# Altium project Rear.PrjPCB (part 1 of 2)
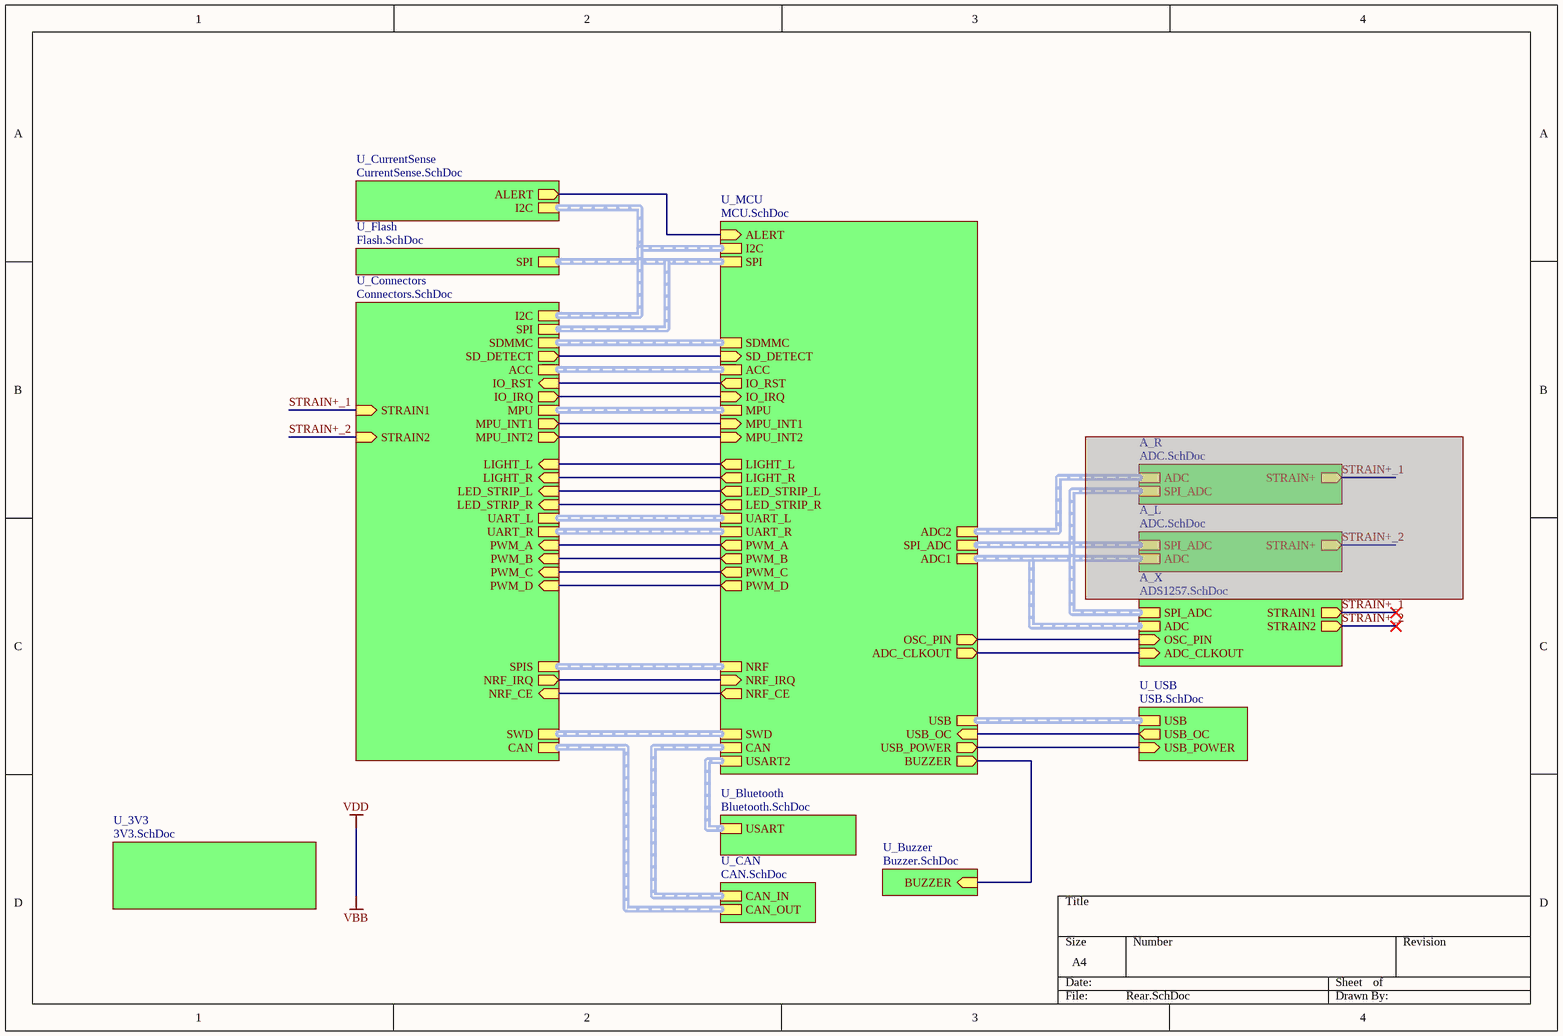
[diagram p0: Rear.SchDoc]
11 sheets, 199 parts. Net scope: hierarchical (ports join the sheet entries above them; power ports are global).
Board file: Rear.PcbDoc
Sheets:
  Rear.SchDoc
    U_CAN = CAN.SchDoc
    U_Bluetooth = Bluetooth.SchDoc
    U_3V3 = 3V3.SchDoc
    U_Flash = Flash.SchDoc
    A_X = ADS1257.SchDoc
    U_MCU = MCU.SchDoc
    U_Connectors = Connectors.SchDoc
    U_USB = USB.SchDoc
    U_CurrentSense = CurrentSense.SchDoc

## Sheet Rear.SchDoc
size A4

### Sub-sheets
A_L = ADC.SchDoc (masked out): SPI_ADC (harness SPI_ADC), ADC (harness ADC), STRAIN+ (out)
A_R = ADC.SchDoc (masked out): SPI_ADC (harness SPI_ADC), ADC (harness ADC), STRAIN+ (out)
A_X = ADS1257.SchDoc: SPI_ADC (harness SPI_ADC), ADC (harness ADC), STRAIN1 (out), STRAIN2 (out), OSC_PIN (in), ADC_CLKOUT (in)
U_3V3 = 3V3.SchDoc: no entries
U_Bluetooth = Bluetooth.SchDoc: USART (harness USART2)
U_Buzzer = Buzzer.SchDoc (file not in this document): BUZZER (in)
U_CAN = CAN.SchDoc: CAN_IN (harness CAN Input), CAN_OUT (harness CAN Output)
U_Connectors = Connectors.SchDoc: CAN (harness CAN Output), MPU (harness I2C), MPU_INT1 (out), MPU_INT2 (out), STRAIN1 (in), STRAIN2 (in), LED_STRIP_L (in), LED_STRIP_R (in), IO_RST (in), IO_IRQ (out), LIGHT_L (in), LIGHT_R (in), SPIS (harness SPI), SDMMC (harness SDMMC), SD_DETECT (out), NRF_CE (in), NRF_IRQ (out), UART_L (harness USART2), UART_R (harness USART2), PWM_A (in), PWM_B (in), PWM_C (in), PWM_D (in), SPI (harness SPI), I2C, ACC, SWD
U_CurrentSense = CurrentSense.SchDoc: ALERT (out), I2C (harness I2C)
U_Flash = Flash.SchDoc: SPI (harness SPI)
U_MCU = MCU.SchDoc: CAN (harness CAN Input), ACC (harness Accessory Outputs), I2C (harness I2C), SPI_ADC (harness SPI_ADC), USART2 (harness USART2), ADC1 (harness ADC), ADC2 (harness ADC), MPU (harness I2C), MPU_INT1 (in), MPU_INT2 (in), SPI, LED_STRIP_L (out), LED_STRIP_R (out), IO_RST (out), IO_IRQ (in), LIGHT_L (out), LIGHT_R (out), NRF (harness SPI), SD_DETECT (in), NRF_CE (out), NRF_IRQ (in), OSC_PIN (out), UART_L (harness USART2), UART_R (harness USART2), PWM_A (out), PWM_B (out), USB (harness USB), BUZZER (out), USB_POWER (out), USB_OC (in), SDMMC, ALERT (in), PWM_C (out), PWM_D (out), SWD (harness SWD), ADC_CLKOUT (out)
U_USB = USB.SchDoc: USB_POWER (in), USB_OC (out), USB (harness USB)

### Nets
ALERT: sheet U_MCU/ALERT, sheet U_CurrentSense/ALERT
BUZZER: sheet U_MCU/BUZZER, sheet U_Buzzer/BUZZER
LIGHT_L: sheet U_MCU/LIGHT_L, sheet U_Connectors/LIGHT_L
LIGHT_R: sheet U_MCU/LIGHT_R, sheet U_Connectors/LIGHT_R
STRAIN+_1: sheet A_X/STRAIN1, sheet U_Connectors/STRAIN1  [project net AINP1]
STRAIN+_2: sheet A_X/STRAIN2, sheet U_Connectors/STRAIN2  [project net AINP2]
NetC94_2: sheet U_MCU/PWM_A, sheet U_Connectors/PWM_A
NetC95_2: sheet U_MCU/PWM_B, sheet U_Connectors/PWM_B
NetC96_2: sheet U_MCU/PWM_C, sheet U_Connectors/PWM_C
NetC97_2: sheet U_MCU/PWM_D, sheet U_Connectors/PWM_D
NetD22_C: sheet U_MCU/USB_OC, sheet U_USB/USB_OC
NetJP8_2: sheet U_MCU/LED_STRIP_L, sheet U_Connectors/LED_STRIP_L
NetJP9_2: sheet U_MCU/LED_STRIP_R, sheet U_Connectors/LED_STRIP_R
NetJP10_1: sheet U_MCU/MPU_INT1, sheet U_Connectors/MPU_INT1
NetJP11_1: sheet U_MCU/MPU_INT2, sheet U_Connectors/MPU_INT2
NetJP18_3: sheet U_MCU/NRF_CE, sheet U_Connectors/NRF_CE
NetJP18_8: sheet U_MCU/NRF_IRQ, sheet U_Connectors/NRF_IRQ
NetJP19_9: sheet U_MCU/SD_DETECT, sheet U_Connectors/SD_DETECT
NetP1_1: sheet U_MCU/IO_IRQ, sheet U_Connectors/IO_IRQ
NetP1_2: sheet U_MCU/IO_RST, sheet U_Connectors/IO_RST
NetR93_1: sheet A_X/OSC_PIN, sheet U_MCU/OSC_PIN
NetR107_2: sheet U_MCU/USB_POWER, sheet U_USB/USB_POWER
NetR118_1: sheet A_X/ADC_CLKOUT, sheet U_MCU/ADC_CLKOUT

### Buses and harness runs
harness sheet A_X/ADC = sheet U_MCU/ADC1
harness sheet A_X/SPI_ADC = sheet U_MCU/SPI_ADC
harness sheet U_Bluetooth/USART = sheet U_MCU/USART2
harness sheet U_CAN/CAN_IN = sheet U_MCU/CAN
harness sheet U_CAN/CAN_OUT = sheet U_Connectors/CAN
harness sheet U_Connectors/ACC = sheet U_MCU/ACC
harness sheet U_Connectors/I2C = sheet U_CurrentSense/I2C = sheet U_MCU/I2C
harness sheet U_Connectors/MPU = sheet U_MCU/MPU
harness sheet U_Connectors/SDMMC = sheet U_MCU/SDMMC
harness sheet U_Connectors/SPI = sheet U_Flash/SPI = sheet U_MCU/SPI
harness sheet U_Connectors/SPIS = sheet U_MCU/NRF
harness sheet U_Connectors/SWD = sheet U_MCU/SWD
harness sheet U_Connectors/UART_L = sheet U_MCU/UART_L
harness sheet U_Connectors/UART_R = sheet U_MCU/UART_R
harness sheet U_MCU/USB = sheet U_USB/USB

## Sheet CAN.SchDoc
size A; SheetNumber: 9
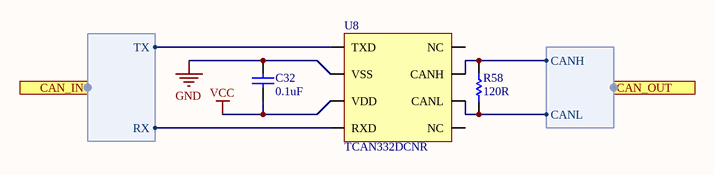
[diagram p1: CAN.SchDoc]

### Parts
C32  value 0.1uF  [C0603[1608X92]]  (hidden comment: 0.1uF 6.3V 0603)
R58  value 120R  [R0603[1608]]  (hidden comment: 120R 1% 0603)
U8  TCAN332DCNR  [SOT-23-8]

### Ports
CAN_IN (harness CAN Input), CAN_OUT (harness CAN Output)

### Harnesses
CAN Input: TX, RX
CAN Output: CANH, CANL

### Nets
GND: C32.2 U8.2(VSS)
VCC: C32.1 U8.3(VDD)
CAN.RX: U8.4(RXD) ; port CAN_IN.RX
CAN.TX: U8.1(TXD) ; port CAN_IN.TX
NetJP3_1: R58.2 U8.7(CANH) ; port CAN_OUT.CANH
NetJP3_2: R58.1 U8.6(CANL) ; port CAN_OUT.CANL

Not connected (* = marked no-connect by the designer): U8 5(NC) 8(NC)

### Library data of the parts
C32 = CAP_0.1uF_6.3V_0603_10%: 0.1uF 6.3V 10% 0603 (1608 Metric); PartNumber: GRM188R70J104KA01D; Manufacturer: Murata; Mounting Technology: Surface Mount; PackageReference: 0603; PackageDescription: 0603 (1608 Metric); Voltage: 6.3V; Tolerance: 10%
R58 = RES_120R_0603_1%: 120R 0.25W 1% 0603 (1005 Metric); Manufacturer: Vishay / Dale; PartNumber: CRCW0603120RFKEAHP; Tolerance: 1%; Power: 0.25W; Mounting Technology: Surface Mount; PackageReference: 0603; PackageDescription: 0603 (1608 Metric); ComponentLink1Description: Datasheet; ComponentLink1URL: http://www.vishay.com/docs/20043/crcwhpe3.pdf
U8 = TCAN332DCNR: CAN Interface IC 3.3-V CAN Transceivers with CAN FD (Flexible Data Rate) 8-SOT-23 -40 to 125; Manufacturer: Texas Instruments; Mounting Technology: Surface Mount; PackageReference: SOT-23-8; PackageDescription: SOT23, 8-Leads; PartNumber: TCAN332DCNR

## Sheet Bluetooth.SchDoc
size A4
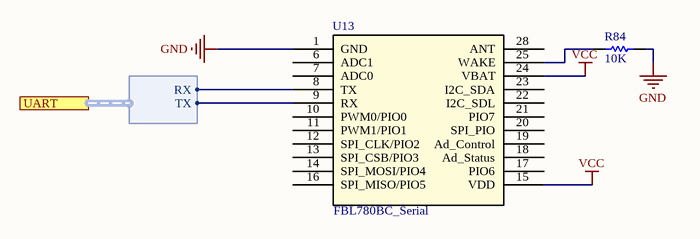
[diagram p2: Bluetooth.SchDoc]

### Parts
R84  value 10K  [R0603[1608]]  (hidden comment: 10K 1% 0603)
U13  FBL780BC_Serial  [FBL780BC_Serial]

### Ports
UART (harness USART2)

### Harnesses
USART2: TX, RX

### Nets
GND: R84.2 U13.1(GND)
VCC: U13.15(VDD) U13.24(VBAT)
NetR84_1: R84.1 U13.25(WAKE)
NetU13_8: U13.8(TX) ; port UART.RX
NetU13_9: U13.9(RX) ; port UART.TX

Not connected (* = marked no-connect by the designer): U13 6(ADC1) 7(ADC0) 10(PWM0/PIO0) 11(PWM1/PIO1) 12(SPI_CLK/PIO2) 13(SPI_CSB/PIO3) 14(SPI_MOSI/PIO4) 16(SPI_MISO/PIO5) 17(PIO6) 18(Ad_Status) 19(Ad_Control) 20(SPI_PIO) 21(PIO7) 22(I2C_SDL) 23(I2C_SDA) 28(ANT)

### Library data of the parts
R84 = RES_10K_0603_1%: 10K 0.25W 1% 0603 (1005 Metric); Manufacturer: Vishay / Dale; PartNumber: CRCW060310K0FKEAHP; Tolerance: 1%; Power: 0.25W; Mounting Technology: Surface Mount; PackageReference: 0603; PackageDescription: 0603 (1608 Metric); ComponentLink1Description: Datasheet; ComponentLink1URL: http://www.vishay.com/docs/20065/rcse3.pdf
U13 = FBL780BC_Serial: Manufacturer: Firmtech; PartNumber: FBL780BC_Serial

## Sheet 3V3.SchDoc
size A; SheetNumber: 2
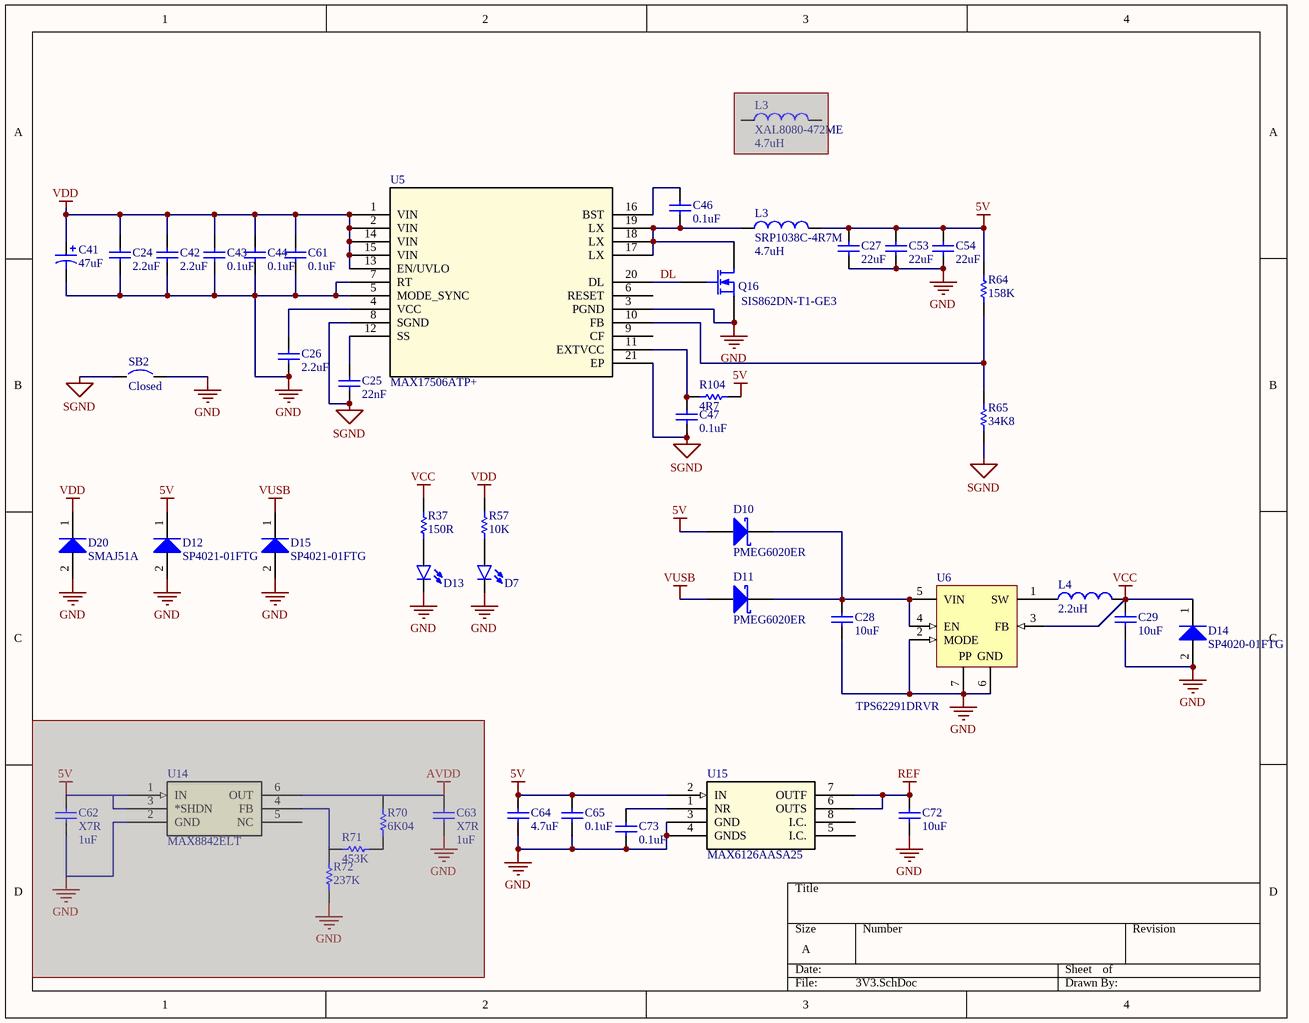
[diagram p3: 3V3.SchDoc]

### Parts
(Parts that share a designator on the sheet are numbered #1, #2 ... from top to bottom, then left to right.)
C24  value 2.2uF  [C1210[3225X200]]  (hidden comment: 2.2uF 100V 1210)
C25  value 22nF  [C0603[1608X92]]  (hidden comment: 22nF 50V 0603)
C26  value 2.2uF  [C0603[1608X92]]  (hidden comment: 2.2uF 10V 0603)
C27  value 22uF  [C1210[3225X250]]  (hidden comment: 22uF 16V 1210)
C28  value 10uF  [C0603[1608X92]]  (hidden comment: 10uF 16V 0603)
C29  value 10uF  [C0603[1608X92]]  (hidden comment: 10uF 6.3V 0603)
C41  value 47uF  [CAP_EEFK_G]  (hidden comment: 47uF 80V)
C42  value 2.2uF  [C1210[3225X200]]  (hidden comment: 2.2uF 100V 1210)
C43  value 0.1uF  [C0603[1608X92]]  (hidden comment: 0.1uF 100V 0603)
C44  value 0.1uF  [C0603[1608X92]]  (hidden comment: 0.1uF 100V 0603)
C46  value 0.1uF  [C0603[1608X92]]  (hidden comment: 0.1uF 16V 0603)
C47  value 0.1uF  [C0603[1608X92]]  (hidden comment: 0.1uF 6.3V 0603)
C53  value 22uF  [C1210[3225X250]]  (hidden comment: 22uF 16V 1210)
C54  value 22uF  [C1210[3225X250]]  (hidden comment: 22uF 16V 1210)
C61  value 0.1uF  [C0603[1608X92]]  (hidden comment: 0.1uF 100V 0603)
C62  value 1uF  TemperatureCoefficient: X7R  [C0603[1608X92]]  (hidden comment: 1uF 16V 0603 X7R)  (masked out: inside a compile mask, not in the netlist)
C63  value 1uF  TemperatureCoefficient: X7R  [C0603[1608X92]]  (hidden comment: 1uF 16V 0603 X7R)  (masked out: inside a compile mask, not in the netlist)
C64  value 4.7uF  [C0603[1608X92]]  (hidden comment: 4.7uF 16V 0603)
C65  value 0.1uF  [C0603[1608X92]]  (hidden comment: 0.1uF 16V 0603)
C72  value 10uF  [C0603[1608X92]]  (hidden comment: 10uF 6.3V 0603)
C73  value 0.1uF  [C0603[1608X92]]  (hidden comment: 0.1uF 16V 0603)
D7  LED_0603_GREEN_5mA  [LED0603]  (value not drawn)
D10  PMEG6020ER  [SOD-123]
D11  PMEG6020ER  [SOD-123]
D12  SP4021-01FTG  [SOD-323]
D13  LED_0603_GREEN_5mA  [LED0603]  (value not drawn)
D14  SP4020-01FTG  [SOD-323]
D15  SP4021-01FTG  [SOD-323]
D20  SMAJ51A  [DO-214AC]
L3#1  XAL8080-472ME  value 4.7uH  [XAL8080]  (masked out: inside a compile mask, not in the netlist)
L3#2  SRP1038C-4R7M  value 4.7uH  [SRP1038C]
L4  2.2uH  [IND0805]
Q16  SIS862DN-T1-GE3  [PowerPak-1212-8]
R37  value 150R  [R0603[1608]]  (hidden comment: 150R 1% 0603)
R57  value 10K  [R0603[1608]]  (hidden comment: 10K 1% 0603)
R64  value 158K  [R0603[1608]]  (hidden comment: 158K 1% 0603)
R65  value 34K8  [R0603[1608]]  (hidden comment: 34K8 1% 0603)
R70  value 6K04  [R0603[1608]]  (hidden comment: 6K04 1% 0603)  (masked out: inside a compile mask, not in the netlist)
R71  value 453K  [R0603[1608]]  (hidden comment: 453K 1% 0603)  (masked out: inside a compile mask, not in the netlist)
R72  value 237K  [R0603[1608]]  (hidden comment: 237K 1% 0603)  (masked out: inside a compile mask, not in the netlist)
R104  value 4R7  [R0603[1608]]  (hidden comment: 4R7 5% 0603)
SB2  Closed  [SB_0603]
U5  MAX17506ATP+  [21-0140L_T2055-4]
U6  TPS62291DRVR  [WSON-6]
U14  MAX8842ELT  [uDFN-6]  (masked out: inside a compile mask, not in the netlist)
U15  MAX6126AASA25  [SOIC-8]

### Nets
5V: C27.2 C53.2 C54.2 C64.2 C65.2 D10.2(A) D12.1(K) L3#2.2 R64.2 R104.2 U15.2(IN)
GND: C24.1 C26.1 C27.1 C28.1 C29.1 C41.2 C42.1 C43.1 C44.1 C53.1 C54.1 C61.1 C64.1 C65.1 C72.2 C73.1 D7.C D12.2(A) D13.C D14.2(A) D15.2(A) D20.2(A) Q16.1(S) SB2.2 U5.3(PGND) U5.5(MODE_SYNC) U5.7(RT) U6.2(MODE) U6.6(GND) U6.7(EP) U15.3(GND) U15.4(GNDS)
REF: C72.1 U15.6(OUTS) U15.7(OUTF)
SGND: C25.1 C47.1 R65.1 SB2.1 U5.8(SGND) U5.21(EP)
VCC: C29.2 D14.1(K) L4.2 R37.2 U6.3(FB)
VDD: C24.2 C41.1 C42.2 C43.2 C44.2 C61.2 D20.1(K) R57.2 U5.1(VIN) U5.2(VIN) U5.13(EN/UVLO) U5.14(VIN) U5.15(VIN)  [project net VBB]
VUSB: D11.2(A) D15.1(K)
DL: Q16.2(G) U5.20(DL)
NetC25_2: C25.2 U5.12(SS)
NetC26_2: C26.2 U5.4(VCC)
NetC28_2: C28.2 D10.1(K) D11.1(K) U6.4(EN) U6.5(VIN)
NetC46_1: C46.1 L3#2.1 Q16.3(D) U5.17(LX) U5.18(LX) U5.19(LX)
NetC46_2: C46.2 U5.16(BST)
NetC47_2: C47.2 R104.1 U5.11(EXTVCC)
NetC73_2: C73.2 U15.1(NR)
NetD7_A: D7.A R57.1
NetD13_A: D13.A R37.1
NetL4_1: L4.1 U6.1(SW)
NetR64_1: R64.1 R65.2 U5.10(FB)

Not connected (* = marked no-connect by the designer): U5 6(RESET) 9(CF); U15 5(I.C.) 8(I.C.)

### Notes on the sheet
- (in symbol TPS62291DRVR) PP

### Library data of the parts
C24 C42 = CAP_2.2uF_100V_1210_10%: 2.2uF 100V 10% 1210 (3225 Metric); PartNumber: GRM32ER72A225KA35; Manufacturer: Murata; Mounting Technology: Surface Mount; PackageReference: 1210; PackageDescription: 1210 (3225 Metric); Voltage: 100V; Tolerance: 10%
C25 = CAP_22nF_50V_0603_10%: 22nF 50V 10% 0603 (1608 Metric); PartNumber: GRM188R71H223KA01D; Manufacturer: Murata; TemperatureCoefficient: X7R; Mounting Technology: Surface Mount; PackageReference: 0603; PackageDescription: 0603 (1608 Metric); Voltage: 50V; Tolerance: 10%
C26 = CAP_2.2uF_10V_0603_10%: 2.2uF 10V 10% 0603 (1608 Metric); PartNumber: GRT188R61A225KE13D; Manufacturer: Murata; TemperatureCoefficient: X5R; Mounting Technology: Surface Mount; PackageReference: 0603; PackageDescription: 0603 (1608 Metric); Voltage: 10V; Tolerance: 10%
C27 C53 C54 = CAP_22uF_16V_1210_20%: 22uF 16V 20% 1210 (3225 Metric); PartNumber: GCJ32ER71C226KE01L; Manufacturer: Murata; Tolerance: 10%; Mounting Technology: Surface Mount; PackageReference: 1210; PackageDescription: 1210 (3225 Metric); Voltage: 16V
C28 = CAP_10uF_16V_0603_10%: 10uF 16V 10% 0603 (1608 Metric); PartNumber: GRM188R61C106KAALD; Manufacturer: Murata; TemperatureCoefficient: X5R; Mounting Technology: Surface Mount; PackageReference: 0603; PackageDescription: 0603 (1608 Metric); Voltage: 16V; Tolerance: 10%
C29 C72 = CAP_10uF_6.3V_0603_10%: 10uF 6.3V 10% 0603 (1608 Metric); PartNumber: GRM188R60J106KE47D; Manufacturer: Murata; TemperatureCoefficient: X5R; Mounting Technology: Surface Mount; PackageReference: 0603; PackageDescription: 0603 (1608 Metric); Voltage: 6.3V; Tolerance: 10%
C41 = CAP_47uF_80V_20%: 47uF 80V 20%; PartNumber: EEE-FK1K470P; Manufacturer: Panasonic; Mounting Technology: Surface Mount; PackageReference: 1H; PackageDescription: 10mm; Voltage: 80V; Tolerance: 20%
C43 C44 C61 = CAP_0.1uF_100V_0603_10%: 0.1uF 100V 10% 0603 (1608 Metric); PartNumber: GRM188R72A104KA35D; Manufacturer: Murata; TemperatureCoefficient: X7R; Mounting Technology: Surface Mount; PackageReference: 0603; PackageDescription: 0603 (1608 Metric); Voltage: 100V; Tolerance: 10%
C46 C65 C73 = CAP_0.1uF_16V_0603_10%: 0.1uF 16V 10% 0603 (1608 Metric); PartNumber: GCM188R71C104KA37D; Manufacturer: Murata; TemperatureCoefficient: X7R; Mounting Technology: Surface Mount; PackageReference: 0603; PackageDescription: 0603 (1608 Metric); Voltage: 16V; Tolerance: 10%
C47 = CAP_0.1uF_6.3V_0603_10%: as C32 on sheet CAN; Mounting Technology: Surface Mount; PackageReference: 0603; PackageDescription: 0603 (1608 Metric); Voltage: 6.3V; Tolerance: 10%
C62 C63 = CAP_1uF_16V_0603_10%_X7R: 1uF 16V 10% 0603 X7R (1608 Metric); PartNumber: GCJ188R71E105KA01D; Manufacturer: Murata; Mounting Technology: Surface Mount; PackageReference: 0603; PackageDescription: 0603 (1608 Metric); Voltage: 16V; Tolerance: 10%
C64 = CAP_4.7uF_16V_0603_10%: 4.7uF 16V 10% 0603 (1608 Metric); PartNumber: GRM188R61A475KE15D; Manufacturer: Murata; TemperatureCoefficient: X5R; Mounting Technology: Surface Mount; PackageReference: 0603; PackageDescription: 0603 (1608 Metric); Voltage: 16V; Tolerance: 10%
D7 D13 = LED_0603_GREEN_5mA: PartNumber: LTST-C193TGKT-5A; Manufacturer: Lite-On Inc.; PackageReference: 0603; PackageDescription: 0603 (1608 Metric); Mounting Technology: Surface Mount
D10 D11 = PMEG6020ER: PartNumber: PMEG6020ER,115; Manufacturer: NXP Semiconductors; PackageReference: SOD-123W; PackageDescription: SOD, 2-Leads, Body 2.69x1.6mm; Mounting Technology: Surface Mount
D12 D15 = SP4021-01FTG: Manufacturer: Littelfuse; PartNumber: SP4021-01FTG; PackageReference: SOD-323-2; Mounting Technology: Surface Mount
D14 = SP4020-01FTG: Manufacturer: Littelfuse; PartNumber: SP4020-01FTG; PackageReference: SOD-323-2; Mounting Technology: Surface Mount
D20 = SMAJ51A-E3/61: Manufacturer: Vishay; PartNumber: SMAJ51A-E3/61; PackageReference: DO-214AC; Mounting Technology: Surface Mount; PackageDescription: DO-214AC, 2 Leads
L3#1 = XAL8080-472ME: 4.7uH 38A 4.08mOhms; PartNumber: XAL8080-472MED; Manufacturer: Coilcraft; Published: 8-Jun-2000; PackageReference: 0402-A; Publisher: Altium Limited; PackageDescription: Chip Inductor
L3#2 = SRP1038C-4R7M: 4.7uH 20% 13A 1038; Manufacturer: Bourns; PartNumber: SRP1038C-4R7M; Mounting Technology: Surface Mount; PackageReference: SRP1038C; Current: 13A
L4 = IND_2.2uH_1.7A_0805_20%: 2.2uH 20% 1.7A 0805; PartNumber: LQM21PN2R2MGHL; Manufacturer: Murata; PackageReference: 0805; PackageDescription: 0805 (2012 metric); Value: 2.2uH; Mounting Technology: Surface Mount; Current: 1.7A
Q16 = SIS862DN-T1-GE3: N-Channel MOSFET; Manufacturer: Vishay; PartNumber: SIS862DN-T1-GE3; Mounting Technology: Surface Mount; PackageReference: PowerPAK-1212-8
R37 = RES_150R_0603_1%: 150R 0.25W 1% 0603 (1005 Metric); Manufacturer: Vishay / Dale; PartNumber: CRCW0603150RFKEAHP; Tolerance: 1%; Power: 0.25W; Mounting Technology: Surface Mount; PackageReference: 0603; PackageDescription: 0603 (1608 Metric); ComponentLink1Description: Datasheet; ComponentLink1URL: http://www.vishay.com/docs/20043/crcwhpe3.pdf
R57 = RES_10K_0603_1%: as R84 on sheet Bluetooth; Tolerance: 1%; Power: 0.25W; Mounting Technology: Surface Mount; PackageReference: 0603; PackageDescription: 0603 (1608 Metric); ComponentLink1Description: Datasheet; ComponentLink1URL: http://www.vishay.com/docs/20065/rcse3.pdf
R64 = RES_158K_0603_1%: 158K 0.1W 1% 0603 (1005 Metric); Manufacturer: Vishay / Dale; PartNumber: CRCW0603158KFKEA; Tolerance: 1%; Power: 0.1W; Mounting Technology: Surface Mount; PackageReference: 0603; PackageDescription: 0603 (1608 Metric); ComponentLink1Description: Datasheet; ComponentLink1URL: http://www.vishay.com/docs/20043/crcwhpe3.pdf
R65 = RES_34K8_0603_1%: 34K8 0.1W 1% 0603 (1005 Metric); Manufacturer: Panasonic; PartNumber: ERJ-3EKF3482V; Tolerance: 1%; Power: 0.1W; Mounting Technology: Surface Mount; PackageReference: 0603; PackageDescription: 0603 (1608 Metric); ComponentLink1Description: Datasheet; ComponentLink1URL: http://www.vishay.com/docs/20043/crcwhpe3.pdf
R70 = RES_6K04_0603_1%: 6K04 0.25W 1% 0603 (1005 Metric); Manufacturer: Vishay / Dale; PartNumber: CRCW06036K04FKEAHP; Tolerance: 1%; Power: 0.25W; Mounting Technology: Surface Mount; PackageReference: 0603; PackageDescription: 0603 (1608 Metric); ComponentLink1Description: Datasheet; ComponentLink1URL: http://www.vishay.com/docs/20043/crcwhpe3.pdf
R71 = RES_453K_0603_1%: 453K 0.25W 1% 0603 (1005 Metric); Manufacturer: Panasonic; PartNumber: ERJ-P03F4533V; Tolerance: 1%; Power: 0.25W; Mounting Technology: Surface Mount; PackageReference: 0603; PackageDescription: 0603 (1608 Metric); ComponentLink1Description: Datasheet; ComponentLink1URL: http://www.vishay.com/docs/20043/crcwhpe3.pdf
R72 = RES_237K_0603_1%: 237K 0.25W 1% 0603 (1005 Metric); Manufacturer: Vishay / Dale; PartNumber: CRCW06036K04FKEAHP; Tolerance: 1%; Power: 0.25W; Mounting Technology: Surface Mount; PackageReference: 0603; PackageDescription: 0603 (1608 Metric); ComponentLink1Description: Datasheet; ComponentLink1URL: http://www.vishay.com/docs/20043/crcwhpe3.pdf
R104 = RES_4R7_0603_5%: 4R7 0.25W 5% 0603 (1005 Metric); Manufacturer: Rohm; PartNumber: ESR03EZPJ4R7; Tolerance: 5%; Power: 0.25W; Mounting Technology: Surface Mount; PackageReference: 0603; PackageDescription: 0603 (1608 Metric); ComponentLink1Description: Datasheet; ComponentLink1URL: http://www.vishay.com/docs/20043/crcwhpe3.pdf
SB2 = Circuit Breaker_close: Circuit Breaker; Published: 24-Mar-1999; Revision: July-2002: Re-released for DXP Platform.; Publisher: Altium Limited
U5 = MAX17506ATP+: Manufacturer: Maxim; Value: Value; Type: Type; RefDes: RefDes; PartNumber: MAX17506ATP+
U6 = TPS62291DRVR: Voltage Regulators - Switching Regulators 2.25MHz 1A Step-Down Cnvrtr 3.3V Output; Manufacturer: Texas Instruments; PartNumber: TPS62291DRVR; PackageReference: WSON-6; PackageDescription: SON, 6-Leads, Body 2x2mm, Pitch 0.65mm, Thermal Pad 1.6x1mm, TI Recommended; Mounting Technology: Surface Mount
U14 = MAX8842ELT: Ultra-Low-Noise, High PSRR, Low-Dropout, / 150mA Linear Regulators in µDFN; Manufacturer: Maxim Integrated; PartNumber: MAX8842ELT+; Value: Value; PackageReference: uDFN-6; Mounting Technology: Surface Mount
U15 = MAX6126AASA25: Ultra-High-Precision, Ultra-Low-Noise, / Series Voltage Reference; Maufacturer: MAXIM; Value: 2.5V; PartNumber: MAX6126AASA25; Mounting Technology: Surface Mount; PackageReference: 8-SOIC; PackageDescription: 8-SOIC, 8-Leads, Body 5x3.9mm

## Sheet Flash.SchDoc
size A; SheetNumber: 12
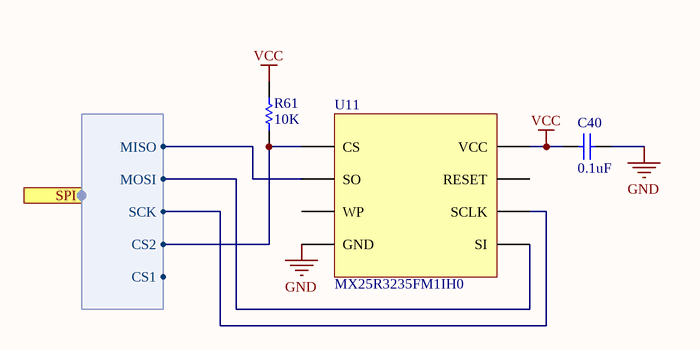
[diagram p4: Flash.SchDoc]

### Parts
C40  value 0.1uF  [C0603[1608X92]]  (hidden comment: 0.1uF 6.3V 0603)
R61  value 10K  [R0603[1608]]  (hidden comment: 10K 1% 0603)
U11  MX25R3235FM1IH0  [SOIC-8]

### Ports
SPI (harness SPI)

### Harnesses
SPI: SCK, MOSI, MISO, CS2, CS1

### Nets
GND: C40.2 U11.4(GND)
VCC: C40.1 R61.2 U11.8(VCC)
SPI2.CS2: R61.1 U11.1(CS) ; port SPI.CS2
SPI2.MISO: U11.2(SO) ; port SPI.MISO
SPI2.MOSI: U11.5(SI) ; port SPI.MOSI
SPI2.SCK: U11.6(SCLK) ; port SPI.SCK

Not connected (* = marked no-connect by the designer): U11 3(WP) 7(RESET)

### Library data of the parts
C40 = CAP_0.1uF_6.3V_0603_10%: as C32 on sheet CAN; Mounting Technology: Surface Mount; PackageReference: 0603; PackageDescription: 0603 (1608 Metric); Voltage: 6.3V; Tolerance: 10%
R61 = RES_10K_0603_1%: as R84 on sheet Bluetooth; Tolerance: 1%; Power: 0.25W; Mounting Technology: Surface Mount; PackageReference: 0603; PackageDescription: 0603 (1608 Metric); ComponentLink1Description: Datasheet; ComponentLink1URL: http://www.vishay.com/docs/20065/rcse3.pdf
U11 = MX25R3235FM1IH0: IC FLASH 32M(4M x 8) SPI 80MHZ 8SOP; Manufacturer: Macronix; PartNumber: MX25R3235FM1IH0; Mounting Technology: Surface Mount; PackageReference: SOP-8

## Sheet ADS1257.SchDoc
size A4
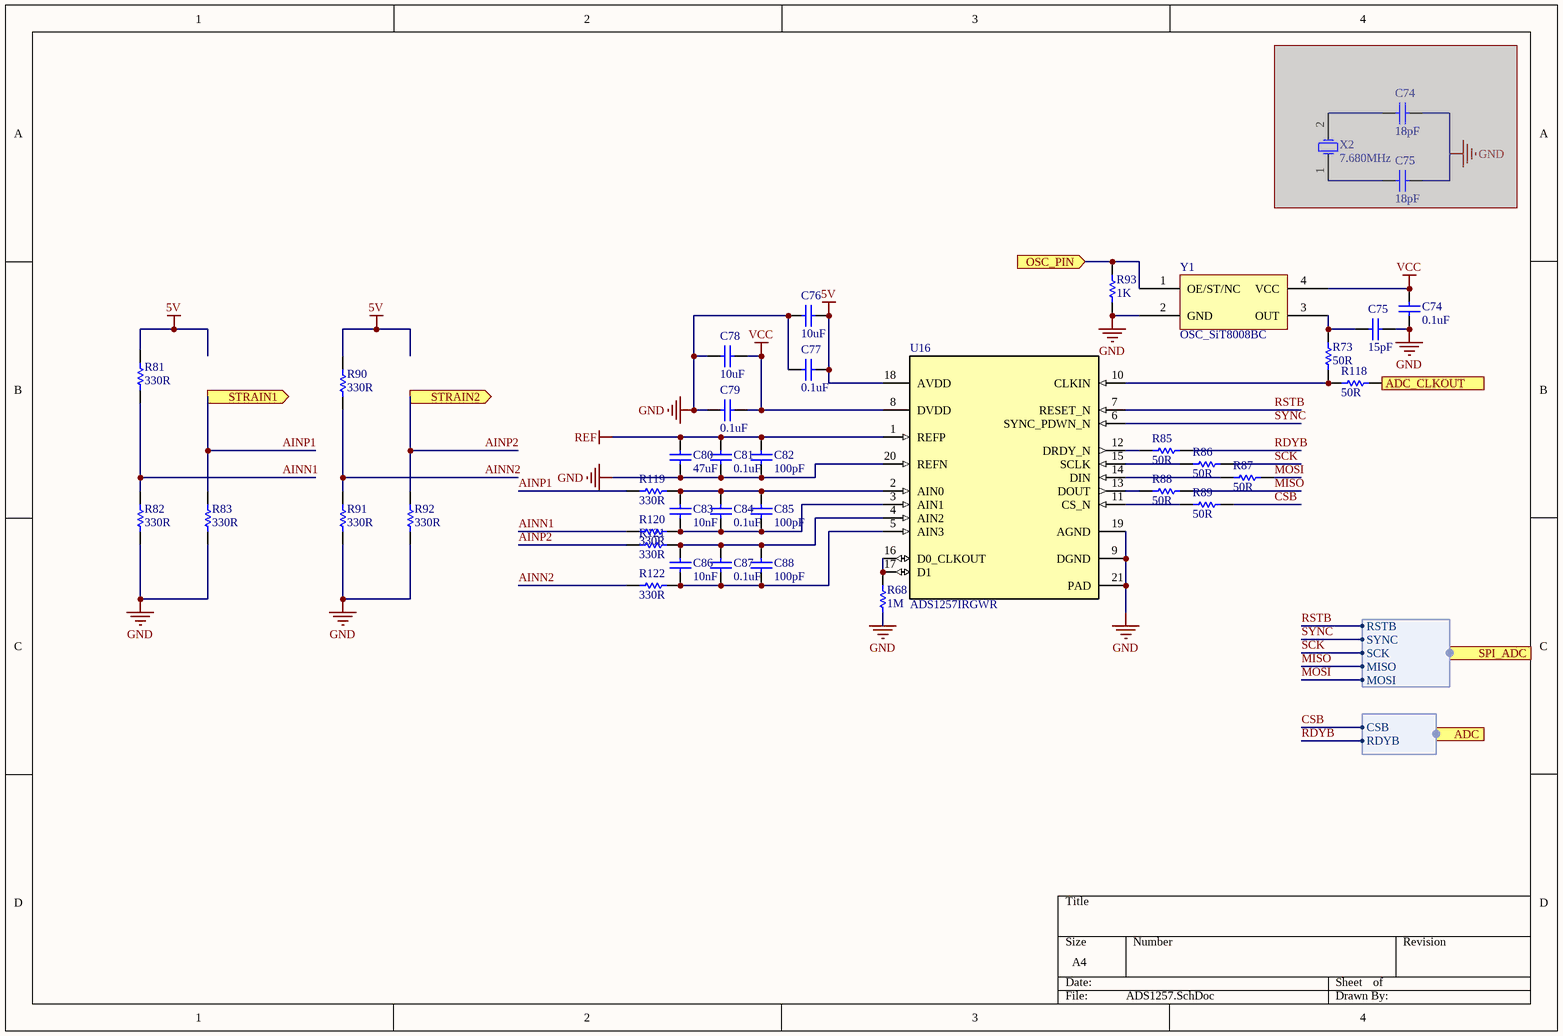
[diagram p5: ADS1257.SchDoc]

### Parts
(Parts that share a designator on the sheet are numbered #1, #2 ... from top to bottom, then left to right.)
C74#1  value 18pF  [C0603[1608X92]]  (hidden comment: 18pF 50V 0603)  (masked out: inside a compile mask, not in the netlist)
C74#2  value 0.1uF  [C0603[1608X92]]  (hidden comment: 0.1uF 16V 0603)
C75#1  value 18pF  [C0603[1608X92]]  (hidden comment: 18pF 50V 0603)  (masked out: inside a compile mask, not in the netlist)
C75#2  value 15pF  [C0603[1608X92]]  (hidden comment: 15pF 50V 0603)
C76  value 10uF  [C0603[1608X92]]  (hidden comment: 10uF 16V 0603)
C77  value 0.1uF  [C0603[1608X92]]  (hidden comment: 0.1uF 16V 0603)
C78  value 10uF  [C0603[1608X92]]  (hidden comment: 10uF 6.3V 0603)
C79  value 0.1uF  [C0603[1608X92]]  (hidden comment: 0.1uF 6.3V 0603)
C80  value 47uF  [C1206[3216X160]]  (hidden comment: 47uF 10V 1206)
C81  value 0.1uF  [C1206[3216X160]]  (hidden comment: 0.1uF 10V 1206)
C82  value 100pF  [C0603[1608X92]]  (hidden comment: 100pF 10V 0603)
C83  value 10nF  [C0805[2012X120]]  (hidden comment: 1uF)
C84  value 0.1uF  [C1206[3216X160]]  (hidden comment: 0.1uF 10V 1206)
C85  value 100pF  [C0603[1608X92]]  (hidden comment: 100pF 10V 0603)
C86  value 10nF  [C0805[2012X120]]  (hidden comment: 1uF)
C87  value 0.1uF  [C1206[3216X160]]  (hidden comment: 0.1uF 10V 1206)
C88  value 100pF  [C0603[1608X92]]  (hidden comment: 100pF 10V 0603)
R68  value 1M  [R0603[1608]]  (hidden comment: 1M 5% 0603)
R73  value 50R  [R0603[1608]]  (hidden comment: 50R 1% 0603)
R81  value 330R  [R0603[1608]]  (hidden comment: 330R 0.1% 0603)
R82  value 330R  [R0603[1608]]  (hidden comment: 330R 0.1% 0603)
R83  value 330R  [R0603[1608]]  (hidden comment: 330R 0.1% 0603)
R85  value 50R  [R0603[1608]]  (hidden comment: 50R 1% 0603)
R86  value 50R  [R0603[1608]]  (hidden comment: 50R 1% 0603)
R87  value 50R  [R0603[1608]]  (hidden comment: 50R 1% 0603)
R88  value 50R  [R0603[1608]]  (hidden comment: 50R 1% 0603)
R89  value 50R  [R0603[1608]]  (hidden comment: 50R 1% 0603)
R90  value 330R  [R0603[1608]]  (hidden comment: 330R 0.1% 0603)
R91  value 330R  [R0603[1608]]  (hidden comment: 330R 0.1% 0603)
R92  value 330R  [R0603[1608]]  (hidden comment: 330R 0.1% 0603)
R93  value 1K  [R0603[1608]]  (hidden comment: 1K 1% 0603)
R118  value 50R  [R0603[1608]]  (hidden comment: 50R 1% 0603)
R119  value 330R  [R0603[1608]]  (hidden comment: 330R 0.1% 0603)
R120  value 330R  [R0603[1608]]  (hidden comment: 330R 0.1% 0603)
R121  value 330R  [R0603[1608]]  (hidden comment: 330R 0.1% 0603)
R122  value 330R  [R0603[1608]]  (hidden comment: 330R 0.1% 0603)
U16  ADS1257IRGWR  [VQFN-20/RGW]
X2  7.680MHz  [OSC_HCN49]  (masked out: inside a compile mask, not in the netlist)
Y1  OSC_SiT8008BC  [OSC_4P_3R2x2R5]

### Ports
ADC (harness ADC), ADC_CLKOUT (in), OSC_PIN (in), SPI_ADC (harness SPI_ADC), STRAIN1 (out), STRAIN2 (out)

### Harnesses
SPI_ADC: MOSI, MISO, SCK, SYNC, RSTB
ADC: CSB, RDYB

### Nets
5V: C76.1 C77.1 R81.2 R90.2 U16.18(AVDD)
GND: C74#2.2 C75#2.1 C76.2 C77.2 C78.2 C79.2 C80.2 C81.2 C82.2 R68.2 R82.1 R83.1 R91.1 R92.1 R93.2 U16.9(DGND) U16.19(AGND) U16.20(REFN) U16.21(PAD) Y1.2(GND)
REF: C80.1 C81.1 C82.1 U16.1(REFP)
VCC: C74#2.1 C78.1 C79.1 U16.8(DVDD) Y1.4(VCC)
AINN1: R81.1 R82.2 R120.2
AINN2: R90.1 R91.2 R122.2
AINP1: R83.2 R119.2 ; port STRAIN1
AINP2: R92.2 R121.2 ; port STRAIN2
CSB: R89.2 ; port ADC.CSB  [project net ADC1.CSB]
MISO: R88.2 ; port SPI_ADC.MISO
MOSI: R87.2 ; port SPI_ADC.MOSI
RDYB: R85.2 ; port ADC.RDYB  [project net ADC1.RDYB]
RSTB: U16.7(RESET_N) ; port SPI_ADC.RSTB
SCK: R86.2 ; port SPI_ADC.SCK
SYNC: U16.6(SYNC_PDWN_N) ; port SPI_ADC.SYNC  [project net SPI_ADC.SYNC]
NetC75#2_2: C75#2.2 R73.2 Y1.3(OUT)
NetC83_1: C83.1 C84.1 C85.1 R119.1 U16.2(AIN0)
NetC83_2: C83.2 C84.2 C85.2 R120.1 U16.3(AIN1)
NetC86_1: C86.1 C87.1 C88.1 R121.1 U16.4(AIN2)
NetC86_2: C86.2 C87.2 C88.2 R122.1 U16.5(AIN3)
NetR68_1: R68.1 U16.16(D0_CLKOUT) U16.17(D1)
NetR73_1: R73.1 R118.2 U16.10(CLKIN)
NetR85_1: R85.1 U16.12(DRDY_N)
NetR86_1: R86.1 U16.15(SCLK)
NetR87_1: R87.1 U16.14(DIN)
NetR88_1: R88.1 U16.13(DOUT)
NetR89_1: R89.1 U16.11(CS_N)
NetR93_1: R93.1 Y1.1(OE/ST/NC) ; port OSC_PIN
NetR118_1: R118.1 ; port ADC_CLKOUT

### Library data of the parts
C74#1 C75#1 = CAP_18pF_50V_0603_1%: 18pF 50V 1% 0603 (1608 Metric); PartNumber: 06035A180FAT2A; Manufacturer: AVX Corporation; TemperatureCoefficient: C0G; Mounting Technology: Surface Mount; PackageReference: 0603; PackageDescription: 0603 (1608 Metric); Voltage: 50V; Tolerance: 1%
C74#2 C77 = CAP_0.1uF_16V_0603_10%: as C46 on sheet 3V3; Mounting Technology: Surface Mount; PackageReference: 0603; PackageDescription: 0603 (1608 Metric); Voltage: 16V; Tolerance: 10%
C75#2 = CAP_15pF_50V_0603_1%: 15pF 50V 1% 0603 (1608 Metric); PartNumber: 06035A150FAT2A; Manufacturer: AVX Corporation; TemperatureCoefficient: C0G; Mounting Technology: Surface Mount; PackageReference: 0603; PackageDescription: 0603 (1608 Metric); Voltage: 50V; Tolerance: 1%
C76 = CAP_10uF_16V_0603_10%: as C28 on sheet 3V3; Mounting Technology: Surface Mount; PackageReference: 0603; PackageDescription: 0603 (1608 Metric); Voltage: 16V; Tolerance: 10%
C78 = CAP_10uF_6.3V_0603_10%: as C29 on sheet 3V3; Mounting Technology: Surface Mount; PackageReference: 0603; PackageDescription: 0603 (1608 Metric); Voltage: 6.3V; Tolerance: 10%
C79 = CAP_0.1uF_6.3V_0603_10%: as C32 on sheet CAN; Mounting Technology: Surface Mount; PackageReference: 0603; PackageDescription: 0603 (1608 Metric); Voltage: 6.3V; Tolerance: 10%
C80 = CAP_47uF_10V_1206_10%: 47uF 10V 10% 1206 (3216 Metric); PartNumber: GRM31CR61A476KE15L; Manufacturer: Murata; Mounting Technology: Surface Mount; PackageReference: 1206; PackageDescription: 1206 (3216 Metric); Voltage: 10V; Tolerance: 10%
C81 C84 C87 = CAP_0.1uF_10V_1206_10%: 0.1uF 10V 10% 1206 (3216 Metric); PartNumber: 885012208009; Manufacturer: Wurth; Mounting Technology: Surface Mount; PackageReference: 1206; PackageDescription: 1206 (3216 Metric); Voltage: 10V; Tolerance: 10%
C82 C85 C88 = CAP_100pF_10V_0603_10%: 100pF 10V 10% 0603 (1608 Metric); PartNumber: 885012206003; Manufacturer: Wurth; TemperatureCoefficient: X7R; Mounting Technology: Surface Mount; PackageReference: 0603; PackageDescription: 0603 (1608 Metric); Voltage: 10V; Tolerance: 10%
C83 C86 = PPS_10nF_16V_0805_2%: PPS_10nF 16V 2% 0805 (2012 metric); Manufacturer: Panasonic; PartNumber: ECH-U1C103GX5; Mounting Technology: Surface Mount; Voltage: 16V; Package Description: 0805 (2012 Metric); Package Reference: 0805; Tolerance: 2%
R68 = RES_1M_0603_5%: 1M 0.25W 5% 0603 (1005 Metric); Manufacturer: Panasonic; PartNumber: ERJ-PA3J105V; Tolerance: 5%; Power: 0.25W; Mounting Technology: Surface Mount; PackageReference: 0603; PackageDescription: 0603 (1608 Metric); ComponentLink1Description: Datasheet; ComponentLink1URL: http://www.vishay.com/docs/20043/crcwhpe3.pdf
R73 R85-R89 R118 = RES_50R_0603_1%: 50R 0.25W 1% 0603 (1005 Metric); Manufacturer: Vishay / Dale; PartNumber: CRCW060349R9FKEAHP; Tolerance: 1%; Power: 0.25W; Mounting Technology: Surface Mount; PackageReference: 0603; PackageDescription: 0603 (1608 Metric); ComponentLink1Description: Datasheet; ComponentLink1URL: http://www.vishay.com/docs/20043/crcwhpe3.pdf
R81-R83 R90-R92 R119-R122 = RES_330R_0603_0.1%: 330R 0.2W 1% 0603 (1005 Metric); Manufacturer: Panasonic; PartNumber: ERJ-PB3B3300V; Tolerance: 0.1%; Power: 0.2W; Mounting Technology: Surface Mount; PackageReference: 0603; PackageDescription: 0603 (1608 Metric); ComponentLink1Description: Datasheet; ComponentLink1URL: http://www.vishay.com/docs/20043/crcwhpe3.pdf
R93 = RES_1K_0603_1%: 1K 0.25W 1% 0603 (1005 Metric); Manufacturer: Vishay / Dale; PartNumber: CRCW06031K00FKEAHP; Tolerance: 1%; Power: 0.25W; Mounting Technology: Surface Mount; PackageReference: 0603; PackageDescription: 0603 (1608 Metric); ComponentLink1Description: Datasheet; ComponentLink1URL: http://www.vishay.com/docs/20043/crcwhpe3.pdf
U16 = ADS1257IRGWR: 24-Bit, 30kSPS, 4-Ch Industrial ADC With Integrated PGA; Manufacturer: Texas Instruments; CompType: IC; PIN_COUNT: 21; Application_BuildNumber: *; PartNumber: ADS1257IRGWR; Alternate_PartNumber: ADS1257IRGW; PackageReference: RGW0020A; MountType: SMT; RefDes: RefDes; TYPE: TYPE; Value: Value
X2 = XTAL_HCM49_7.68MHz: Crystal Oscillator; Manufacturer: Citizen Finedevice Co Ltd; PartNumber: HCM497680000ABJT; Load Capacitance: 18pF; PackageReference: HC-49; Value: 7.680MHz
Y1 = OSC_SiT8008BC: Manufacturer: SiTIME; PartNumber: SiT8008BCT; PackageDescription: 4-SMD

## Sheet MCU.SchDoc
size A3; SheetNumber: 3
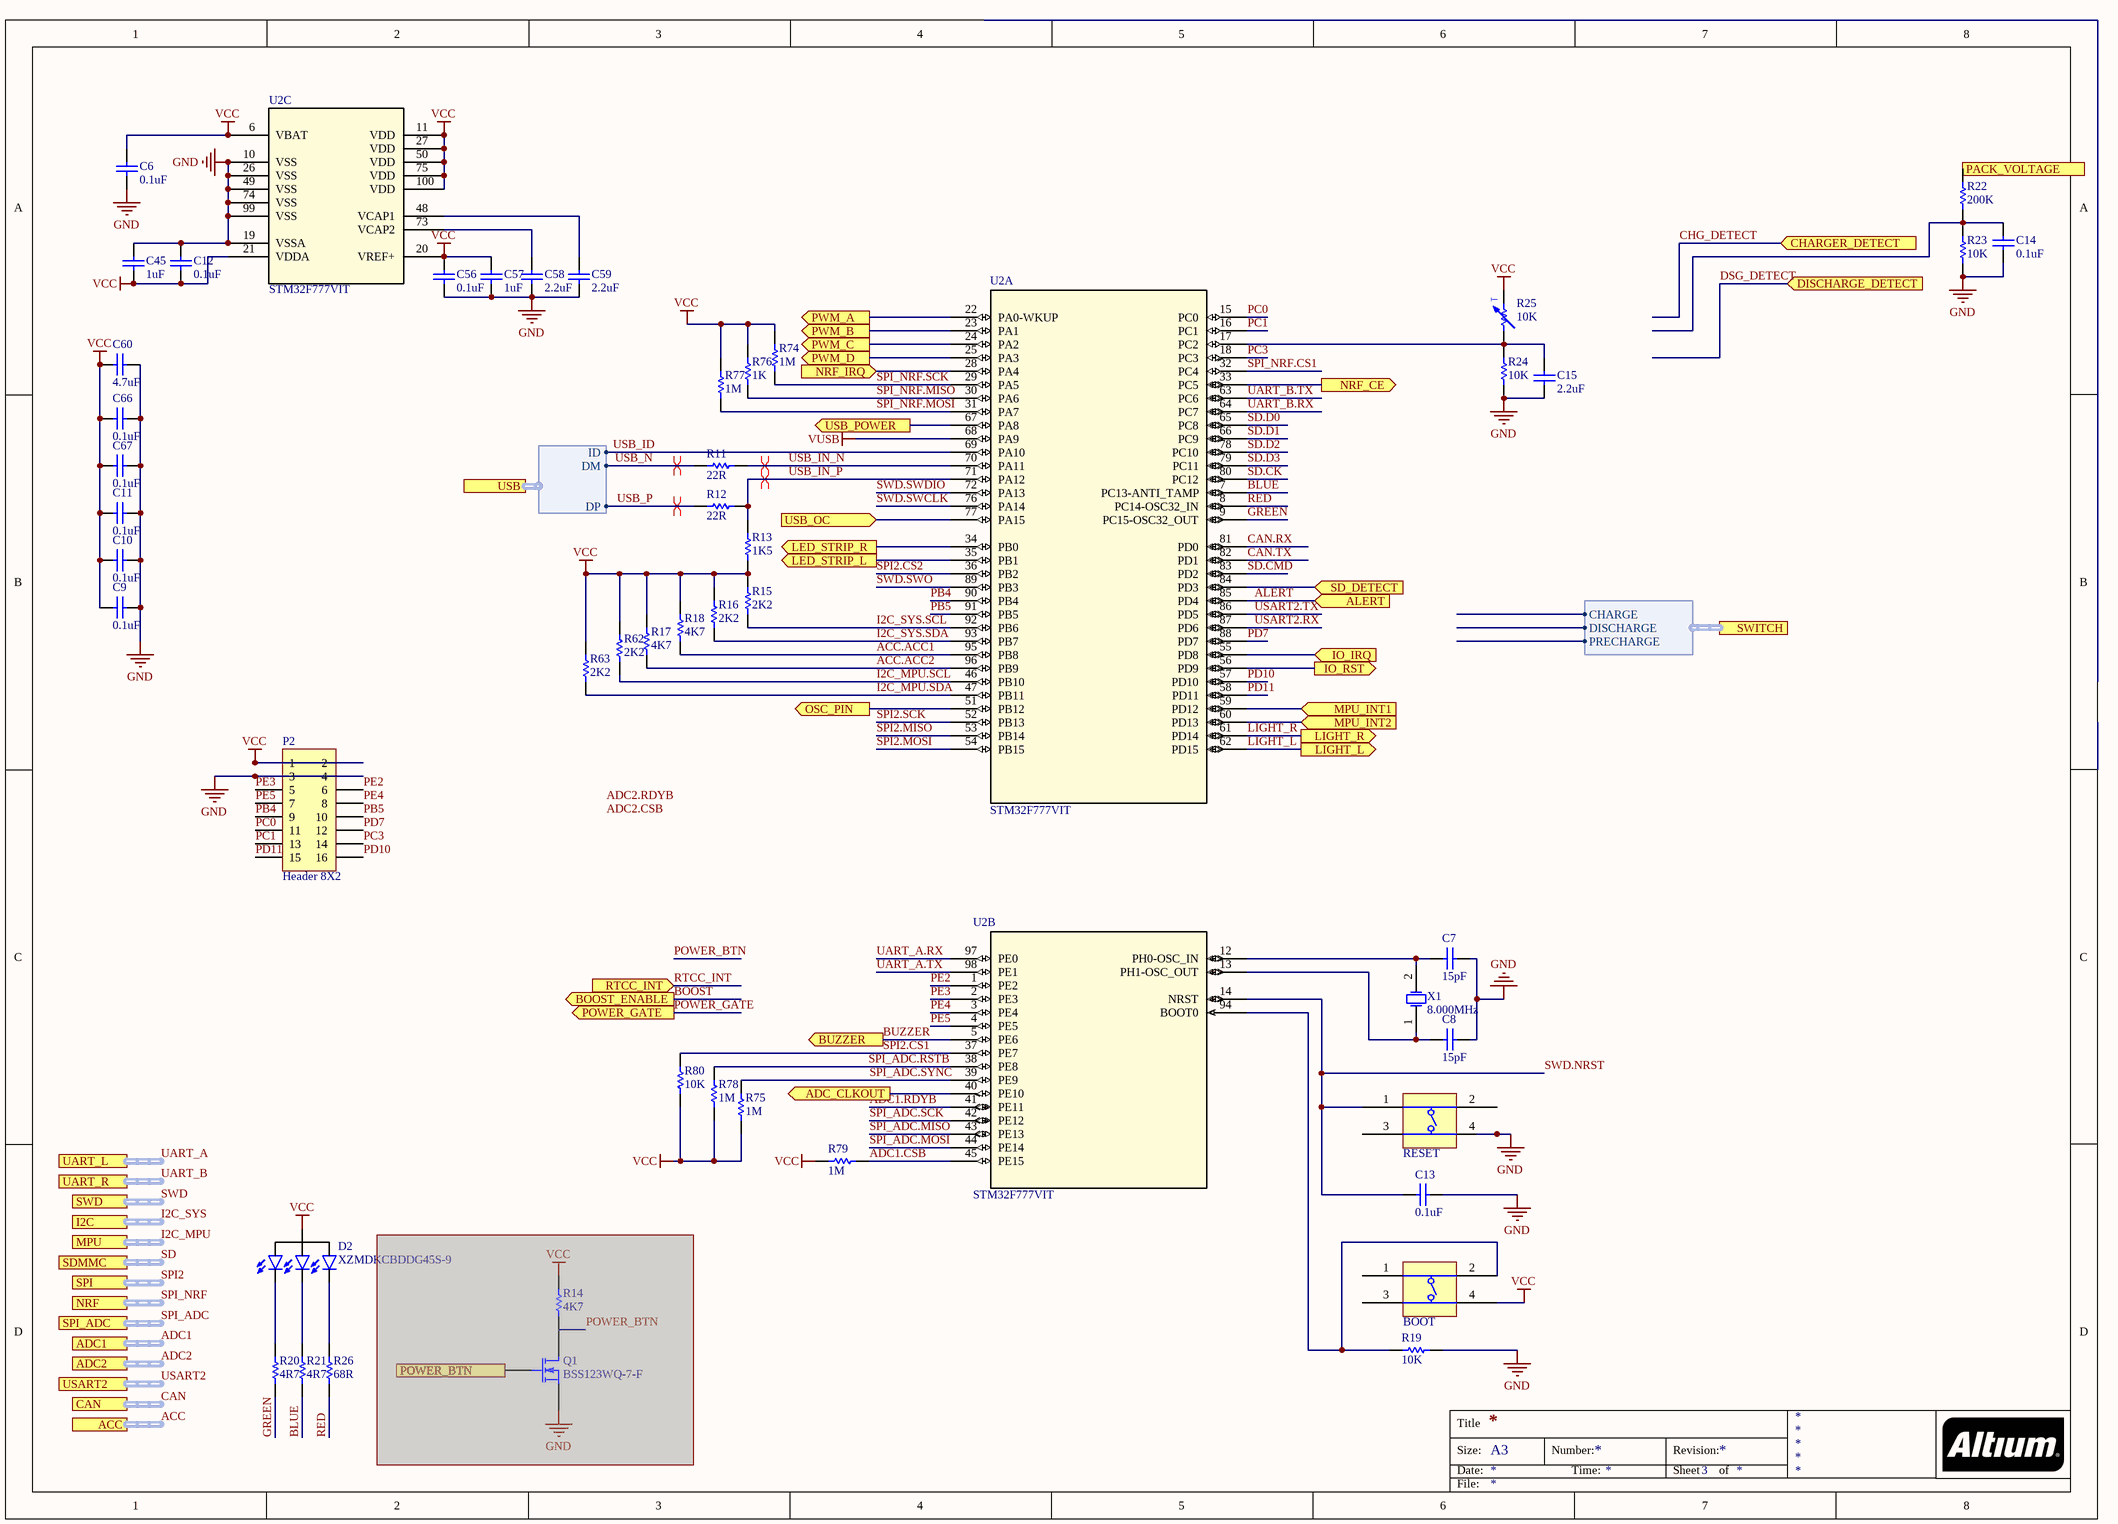
[diagram p6: MCU.SchDoc]

### Parts
BOOT  DIPT-DTSM-6  [SWITCH]  (value not drawn)
C6  value 0.1uF  [C0603[1608X92]]  (hidden comment: 0.1uF 6.3V 0603)
C7  value 15pF  [C0603[1608X92]]  (hidden comment: 15pF 50V 0603)
C8  value 15pF  [C0603[1608X92]]  (hidden comment: 15pF 50V 0603)
C9  value 0.1uF  [C0603[1608X92]]  (hidden comment: 0.1uF 6.3V 0603)
C10  value 0.1uF  [C0603[1608X92]]  (hidden comment: 0.1uF 6.3V 0603)
C11  value 0.1uF  [C0603[1608X92]]  (hidden comment: 0.1uF 6.3V 0603)
C12  value 0.1uF  [C0603[1608X92]]  (hidden comment: 0.1uF 6.3V 0603)
C13  value 0.1uF  [C0603[1608X92]]  (hidden comment: 0.1uF 6.3V 0603)
C14  value 0.1uF  [C0603[1608X92]]  (hidden comment: 0.1uF 6.3V 0603)
C15  value 2.2uF  [C0603[1608X92]]  (hidden comment: 2.2uF 6.3V 0603)
C45  value 1uF  [C0603[1608X92]]  (hidden comment: 1uF 6.3V 0603)
C56  value 0.1uF  [C0603[1608X92]]  (hidden comment: 0.1uF 6.3V 0603)
C57  value 1uF  [C0603[1608X92]]  (hidden comment: 1uF 6.3V 0603)
C58  value 2.2uF  [C1206[3216X160]]  (hidden comment: 2.2uF 16V 1206)
C59  value 2.2uF  [C1206[3216X160]]  (hidden comment: 2.2uF 16V 1206)
C60  value 4.7uF  [C0603[1608X92]]  (hidden comment: 4.7uF 6.3V 0603)
C66  value 0.1uF  [C0603[1608X92]]  (hidden comment: 0.1uF 6.3V 0603)
C67  value 0.1uF  [C0603[1608X92]]  (hidden comment: 0.1uF 6.3V 0603)
D2  XZMDKCBDDG45S-9  [XZMDKCBDDG45S-9]
P2  Header 8X2  [HDR2X8]
Q1  BSS123WQ-7-F  [SOT323-3]  (masked out: inside a compile mask, not in the netlist)
R11  value 22R  [R0603[1608]]  (hidden comment: 22R 1% 0603)
R12  value 22R  [R0603[1608]]  (hidden comment: 22R 1% 0603)
R13  value 1K5  [R0603[1608]]  (hidden comment: 1K5 1% 0603)
R14  value 4K7  [R0603[1608]]  (hidden comment: 4K7 1% 0603)  (masked out: inside a compile mask, not in the netlist)
R15  value 2K2  [R0603[1608]]  (hidden comment: 2K2 1% 0603)
R16  value 2K2  [R0603[1608]]  (hidden comment: 2K2 1% 0603)
R17  value 4K7  [R0603[1608]]  (hidden comment: 4K7 1% 0603)
R18  value 4K7  [R0603[1608]]  (hidden comment: 4K7 1% 0603)
R19  value 10K  [R0603[1608]]  (hidden comment: 10K 1% 0603)
R20  value 4R7  [R0603[1608]]  (hidden comment: 4R7 5% 0603)
R21  value 4R7  [R0603[1608]]  (hidden comment: 4R7 5% 0603)
R22  value 200K  [R0603[1608]]  (hidden comment: 200K 1% 0603)
R23  value 10K  [R0603[1608]]  (hidden comment: 10K 1% 0603)
R24  value 10K  [R0603[1608]]  (hidden comment: 10K 1% 0603)
R25  value 10K  [R0603[1608]]  (hidden comment: 10K 0.5% 0603)
R26  value 68R  [R0603[1608]]  (hidden comment: 68R 1% 0603)
R62  value 2K2  [R0603[1608]]  (hidden comment: 2K2 1% 0603)
R63  value 2K2  [R0603[1608]]  (hidden comment: 2K2 1% 0603)
R74  value 1M  [R0603[1608]]  (hidden comment: 1M 5% 0603)
R75  value 1M  [R0603[1608]]  (hidden comment: 1M 5% 0603)
R76  value 1K  [R0603[1608]]  (hidden comment: 1K 1% 0603)
R77  value 1M  [R0603[1608]]  (hidden comment: 1M 5% 0603)
R78  value 1M  [R0603[1608]]  (hidden comment: 1M 5% 0603)
R79  value 1M  [R0603[1608]]  (hidden comment: 1M 5% 0603)
R80  value 10K  [R0603[1608]]  (hidden comment: 10K 1% 0603)
RESET  DIPT-DTSM-6  [SWITCH]  (value not drawn)
U2  STM32F777VIT  [LQFP-100_14X14mm]  (parts A,B,C of 3)
X1  8.000MHz  [OSC_2SM_3R2x2R5]

### Ports
ACC (harness Accessory Outputs), ADC1 (harness ADC), ADC2 (harness ADC), ADC_CLKOUT (out), ALERT (in), BOOST_ENABLE (out), BUZZER (out), CAN (harness CAN Input), CHARGER_DETECT (in), DISCHARGE_DETECT (in), I2C (harness I2C), IO_IRQ (in), IO_RST (out), LED_STRIP_L (out), LED_STRIP_R (out), LIGHT_L (out), LIGHT_R (out), MPU (harness I2C), MPU_INT1 (in), MPU_INT2 (in), NRF (harness SPI), NRF_CE (out), NRF_IRQ (in), OSC_PIN (out), PACK_VOLTAGE (in), POWER_BTN (in), POWER_GATE (out), PWM_A (out), PWM_B (out), PWM_C (out), PWM_D (out), RTCC_INT (in), SD_DETECT (in), SDMMC (harness SDMMC), SPI (harness SPI), SPI_ADC (harness SPI_ADC), SWD (harness SWD), SWITCH (harness Switches), UART_L (harness USART2), UART_R (harness USART2), USART2 (harness USART2), USB (harness USB), USB_OC (in), USB_POWER (out)

### Harnesses
Switches: CHARGE, DISCHARGE, PRECHARGE
USB: DM, DP, ID

### Nets
GND: C6.1 C7.2 C8.2 C9.2 C10.2 C11.2 C12.2 C13.2 C14.1 C15.1 C45.2 C56.1 C57.1 C58.1 C59.1 C60.2 C66.2 C67.2 P2.3 P2.4 R19.2 R23.1 R24.1 RESET.4 U2.10(VSS) U2.19(VSSA) U2.26(VSS) U2.49(VSS) U2.74(VSS) U2.99(VSS)
VCC: BOOT.4 C6.2 C9.1 C10.1 C11.1 C12.1 C45.1 C56.2 C57.2 C60.1 C66.1 C67.1 D2.2(A) P2.1 P2.2 R13.1 R15.1 R16.1 R17.2 R18.2 R25.2 R62.1 R63.2 R74.1 R75.2 R76.1 R77.1 R78.2 R79.1 R80.2 U2.6(VBAT) U2.11(VDD) U2.20(VREF+) U2.21(VDDA) U2.27(VDD) U2.50(VDD) U2.75(VDD) U2.100(VDD)
VUSB: U2.68(PA9)
ACC.ACC1: R18.1 U2.95(PB8)
ACC.ACC2: R17.1 U2.96(PB9)
ADC1.CSB: R79.2 U2.45(PE15)
ADC1.RDYB: U2.41(PE11)
ALERT: U2.85(PD4) ; port ALERT
BLUE: R21.1 U2.7(PC13-ANTI_TAMP)
BOOST: port BOOST_ENABLE
BUZZER: U2.5(PE6) ; port BUZZER
CAN.RX: U2.81(PD0)
CAN.TX: U2.82(PD1)
CHG_DETECT: port CHARGER_DETECT
DSG_DETECT: port DISCHARGE_DETECT
GREEN: R20.1 U2.9(PC15-OSC32_OUT)
I2C_MPU.SCL: R62.2 U2.46(PB10)
I2C_MPU.SDA: R63.1 U2.47(PB11)
I2C_SYS.SCL: R15.2 U2.92(PB6)
I2C_SYS.SDA: R16.2 U2.93(PB7)
LIGHT_L: U2.62(PD15) ; port LIGHT_L
LIGHT_R: U2.61(PD14) ; port LIGHT_R
PB4: P2.9 U2.90(PB4)
PB5: P2.10 U2.91(PB5)
PC0: P2.11 U2.15(PC0)
PC1: P2.13 U2.16(PC1)
PC3: P2.14 U2.18(PC3)
PD7: P2.12 U2.88(PD7)
PD10: P2.16 U2.57(PD10)
PD11: P2.15 U2.58(PD11)
PE2: P2.6 U2.1(PE2)
PE3: P2.5 U2.2(PE3)
PE4: P2.8 U2.3(PE4)
PE5: P2.7 U2.4(PE5)
POWER_GATE: port POWER_GATE
RED: R26.1 U2.8(PC14-OSC32_IN)
RTCC_INT: port RTCC_INT
SD.CK: U2.80(PC12)
SD.CMD: U2.83(PD2)
SD.D0: U2.65(PC8)
SD.D1: U2.66(PC9)
SD.D2: U2.78(PC10)
SD.D3: U2.79(PC11)
SPI2.CS1: R80.1 U2.37(PE7)
SPI2.CS2: U2.36(PB2)
SPI2.MISO: U2.53(PB14)
SPI2.MOSI: U2.54(PB15)
SPI2.SCK: U2.52(PB13)
SPI_ADC.MISO: U2.43(PE13)
SPI_ADC.MOSI: U2.44(PE14)
SPI_ADC.RSTB: R78.1 U2.38(PE8)
SPI_ADC.SCK: U2.42(PE12)
SPI_ADC.SYNC: R75.1 U2.39(PE9)
SPI_NRF.CS1: U2.32(PC4)
SPI_NRF.MISO: R76.2 U2.30(PA6)
SPI_NRF.MOSI: R77.2 U2.31(PA7)
SPI_NRF.SCK: R74.2 U2.29(PA5)
SWD.NRST: C13.1 RESET.1 U2.14(NRST)
SWD.SWCLK: U2.76(PA14)
SWD.SWDIO: U2.72(PA13)
SWD.SWO: U2.89(PB3)
UART_A.RX: U2.97(PE0)
UART_A.TX: U2.98(PE1)
UART_B.RX: U2.64(PC7)
UART_B.TX: U2.63(PC6)
USART2.RX: U2.87(PD6)
USART2.TX: U2.86(PD5)
USB_ID: U2.69(PA10) ; port USB.ID
USB_IN_N: R11.2 U2.70(PA11)
USB_IN_P: R12.2 R13.2 U2.71(PA12)
USB_N: R11.1 ; port USB.DM
USB_P: R12.1 ; port USB.DP
NetBOOT_2: BOOT.2 R19.1 U2.94(BOOT0)
NetC7_1: C7.1 U2.12(PH0-OSC_IN) X1.2(OSC2)
NetC8_1: C8.1 U2.13(PH1-OSC_OUT) X1.1(OSC1)
NetC14_2: C14.2 R22.1 R23.2
NetC15_2: C15.2 R24.2 R25.1 U2.17(PC2)
NetC58_2: C58.2 U2.73(VCAP2)
NetC59_2: C59.2 U2.48(VCAP1)
NetC94_2: U2.22(PA0-WKUP) ; port PWM_A
NetC95_2: U2.23(PA1) ; port PWM_B
NetC96_2: U2.24(PA2) ; port PWM_C
NetC97_2: U2.25(PA3) ; port PWM_D
NetD2_1: D2.1(K_Red) R26.2
NetD2_3: D2.3(K_Blue) R21.2
NetD2_4: D2.4(K_Green) R20.2
NetD22_C: U2.77(PA15) ; port USB_OC
NetJP8_2: U2.35(PB1) ; port LED_STRIP_L
NetJP9_2: U2.34(PB0) ; port LED_STRIP_R
NetJP10_1: U2.59(PD12) ; port MPU_INT1
NetJP11_1: U2.60(PD13) ; port MPU_INT2
NetJP18_3: U2.33(PC5) ; port NRF_CE
NetJP18_8: U2.28(PA4) ; port NRF_IRQ
NetJP19_9: U2.84(PD3) ; port SD_DETECT
NetP1_1: U2.55(PD8) ; port IO_IRQ
NetP1_2: U2.56(PD9) ; port IO_RST
NetR22_2: R22.2 ; port PACK_VOLTAGE
NetR93_1: U2.51(PB12) ; port OSC_PIN
NetR107_2: U2.67(PA8) ; port USB_POWER
NetR118_1: U2.40(PE10) ; port ADC_CLKOUT

Not connected (* = marked no-connect by the designer): BOOT 1 3; RESET 2 3

### Buses and harness runs
harness ACC = port ACC
harness ADC1 = port ADC1
harness ADC2 = port ADC2
harness CAN = port CAN
harness I2C_MPU = port MPU
harness I2C_SYS = port I2C
harness SD = port SDMMC
harness SPI2 = port SPI
harness SPI_ADC = port SPI_ADC
harness SPI_NRF = port NRF
harness SWD = port SWD
harness UART_A = port UART_L
harness UART_B = port UART_R
harness USART2 = port USART2

### Layout directives
differential pair; rule Width Constraint [Pref Width = 10mil    Min Width = 10mil    Max Width = 10mil]: USB_N
differential pair: USB_IN_N, USB_IN_P, USB_P

### Notes on the sheet
- Labels drawn without touching a wire or pin: ADC2.CSB, ADC2.RDYB
- Title
- Size:
- Date:
- A3
- Number:
- Time:
- Revision:
- Sheet
- of
- File:
- (in symbol NTC_10K_0603_0.5%) T

### Library data of the parts
BOOT RESET = DIPT-DTSM-6: Switch, SPNO Push Button SMD; Manufacturer: C&K Components; PartNumber: PTS810 SJM 250 SMTR LFS; PackageReference: PTS810
C6 C9-C14 C56 C66 C67 = CAP_0.1uF_6.3V_0603_10%: as C32 on sheet CAN; Mounting Technology: Surface Mount; PackageReference: 0603; PackageDescription: 0603 (1608 Metric); Voltage: 6.3V; Tolerance: 10%
C7 C8 = CAP_15pF_50V_0603_1%: as C75#2 on sheet ADS1257; Mounting Technology: Surface Mount; PackageReference: 0603; PackageDescription: 0603 (1608 Metric); Voltage: 50V; Tolerance: 1%
C15 = CAP_2.2uF_6.3V_0603_10%: 2.2uF 6.3V 10% 0603 (1608 Metric); PartNumber: GRM185R60J225KE26D; Manufacturer: Murata; TemperatureCoefficient: X5R; Mounting Technology: Surface Mount; PackageReference: 0603; PackageDescription: 0603 (1608 Metric); Voltage: 6.3V; Tolerance: 10%
C45 C57 = CAP_1uF_6.3V_0603_10%: 1uF 6.3V 10% 0603 (1608 Metric); PartNumber: GRM188R60J105KA01D; Manufacturer: Murata; TemperatureCoefficient: X5R; Mounting Technology: Surface Mount; PackageReference: 0603; PackageDescription: 0603 (1608 Metric); Voltage: 6.3V; Tolerance: 10%
C58 C59 = CAP_2.2uF_16V_1206_10%: 2.2uF 16V 10% X7R 1206 (3216 Metric); PartNumber: C1206C225K4RACAUTO; Manufacturer: KEMET; Mounting Technology: Surface Mount; PackageReference: 1206; PackageDescription: 1206 (3216 Metric); Voltage: 16V; Tolerance: 10%
C60 = CAP_4.7uF_6.3V_0603_10%: 4.7uF 6.3V 10% 0603 (1608 Metric); PartNumber: GRM188R60J475KE19J; Manufacturer: Murata; TemperatureCoefficient: X5R; Mounting Technology: Surface Mount; PackageReference: 0603; PackageDescription: 0603 (1608 Metric); Voltage: 6.3V; Tolerance: 10%
D2 = XZMDKCBDDG45S-9: Manufacturer: SunLED; PartNumber: XZMDKCBDDG45S-9; PackageReference: 4-PLCC; Mounting Technology: Surface Mount; PackageDescription: 4-SMD, Gull Wing,  3.20mm L x 2.80mm W
P2 = Header 8X2: Header, 8-Pin, Dual row; LatestRevisionDate: 17-Jul-2002; LatestRevisionNote: Re-released for DXP Platform.; Publisher: Altium Limited
Q1 = BSS123WQ-7-F: N-Channel MOSFET; Manufacturer: Diodes Incorporated; PackageReference: SOT-323-3; PartNumber: BSS123WQ-7-F; Mounting Technology: Surface Mount
R11 R12 = RES_22R_0603_1%: 22R 0.25W 1% 0603 (1005 Metric); Manufacturer: Vishay / Dale; PartNumber: CRCW060322R0FKEAHP; Tolerance: 1%; Power: 0.25W; Mounting Technology: Surface Mount; PackageReference: 0603; PackageDescription: 0603 (1608 Metric); ComponentLink1Description: Datasheet; ComponentLink1URL: http://www.vishay.com/docs/20043/crcwhpe3.pdf
R13 = RES_1K5_0603_1%: 1K5 0.25W 1% 0603 (1005 Metric); Manufacturer: Vishay / Dale; PartNumber: CRCW06031K50FKEAHP; Tolerance: 1%; Power: 0.25W; Mounting Technology: Surface Mount; PackageReference: 0603; PackageDescription: 0603 (1608 Metric); ComponentLink1Description: Datasheet; ComponentLink1URL: http://www.vishay.com/docs/20043/crcwhpe3.pdf
R14 R17 R18 = RES_4K7_0603_1%: 4K7 0.25W 1% 0603 (1005 Metric); Manufacturer: Vishay / Dale; PartNumber: CRCW06034K70FKEAHP; Tolerance: 1%; Power: 0.25W; Mounting Technology: Surface Mount; PackageReference: 0603; PackageDescription: 0603 (1608 Metric); ComponentLink1Description: Datasheet; ComponentLink1URL: http://www.vishay.com/docs/20043/crcwhpe3.pdf
R15 R16 R62 R63 = RES_2K2_0603_1%: 2K2 0.25W 1% 0603 (1005 Metric); Manufacturer: Vishay / Dale; PartNumber: CRCW06032K20FKEAHP; Tolerance: 1%; Power: 0.25W; Mounting Technology: Surface Mount; PackageReference: 0603; PackageDescription: 0603 (1608 Metric); ComponentLink1Description: Datasheet; ComponentLink1URL: http://www.vishay.com/docs/20043/crcwhpe3.pdf
R19 R23 R24 R80 = RES_10K_0603_1%: as R84 on sheet Bluetooth; Tolerance: 1%; Power: 0.25W; Mounting Technology: Surface Mount; PackageReference: 0603; PackageDescription: 0603 (1608 Metric); ComponentLink1Description: Datasheet; ComponentLink1URL: http://www.vishay.com/docs/20065/rcse3.pdf
R20 R21 = RES_4R7_0603_5%: as R104 on sheet 3V3; Tolerance: 5%; Power: 0.25W; Mounting Technology: Surface Mount; PackageReference: 0603; PackageDescription: 0603 (1608 Metric); ComponentLink1Description: Datasheet; ComponentLink1URL: http://www.vishay.com/docs/20043/crcwhpe3.pdf
R22 = RES_200K_0603_1%: 200K 0.25W 1% 0603 (1005 Metric); Manufacturer: Rohm Semiconductor; PartNumber: ESR03EZPJ204; Tolerance: 5%; Power: 0.25W; Mounting Technology: Surface Mount; PackageReference: 0603; PackageDescription: 0603 (1608 Metric); ComponentLink1Description: Datasheet; ComponentLink1URL: http://www.vishay.com/docs/20043/crcwhpe3.pdf
R25 = NTC_10K_0603_0.5%: NTC 10K 0.5% 0603 (1608 Metric); PartNumber: NCP18XH103D60RC; Manufacturer: Murata; Power: 0.1W; Mounting Technology: Surface Mount; PackageReference: 0603; PackageDescription: 0603 (1608 Metric); Tolerance: 0.5%
R26 = RES_68R_0603_1%: 68R 0.25W 1% 0603 (1005 Metric); Manufacturer: Panasonic; PartNumber: ERJ-PA3F68R0V; Tolerance: 1%; Power: 0.25W; Mounting Technology: Surface Mount; PackageReference: 0603; PackageDescription: 0603 (1608 Metric); ComponentLink1Description: Datasheet; ComponentLink1URL: http://www.vishay.com/docs/20043/crcwhpe3.pdf
R74 R75 R77-R79 = RES_1M_0603_5%: as R68 on sheet ADS1257; Tolerance: 5%; Power: 0.25W; Mounting Technology: Surface Mount; PackageReference: 0603; PackageDescription: 0603 (1608 Metric); ComponentLink1Description: Datasheet; ComponentLink1URL: http://www.vishay.com/docs/20043/crcwhpe3.pdf
R76 = RES_1K_0603_1%: as R93 on sheet ADS1257; Tolerance: 1%; Power: 0.25W; Mounting Technology: Surface Mount; PackageReference: 0603; PackageDescription: 0603 (1608 Metric); ComponentLink1Description: Datasheet; ComponentLink1URL: http://www.vishay.com/docs/20043/crcwhpe3.pdf
U2 = STM32F777VIT: Imported; Manufacturer: STMicroelectronics; Value: Value; Type: Type; RefDes: RefDes; PartNumber: STM32F777VIT
X1 = XTAL_NX3225GD_8MHZ: Crystal Oscillator; Manufacturer: NX; PartNumber: NX3225GD-8MHZ-STD-CRA-3; PackageReference: 2-SMD; Value: 8.000MHz